# EAGLE schematic Multivibrator (EAGLE 9.6.2)
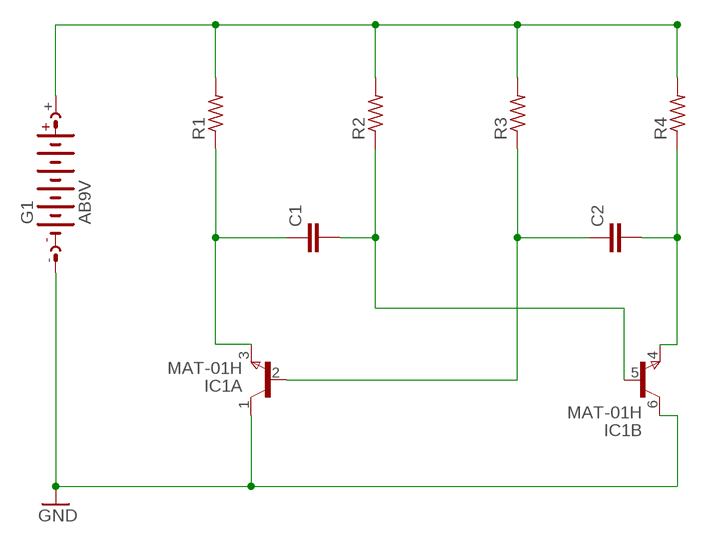
[diagram p0: schematic, sheet 1]

## Parts
C1  C2,5-3  [C2.5-3]
C2  C2,5-3  [C2.5-3]
G1  AB9V  [AB9V]
IC1  MAT-01H  [TO78]
R1  R-US_R0805  [R0805]
R2  R-US_R0805  [R0805]
R3  R-US_R0805  [R0805]
R4  R-US_R0805  [R0805]

## Nets
GND: G1.- IC1.1(A:C) IC1.6(B:C)
N$1: G1.+ R1.2 R2.2 R3.2 R4.2
N$2: C1.1 IC1.3(A:E) R1.1
N$3: C1.2 IC1.5(B:B) R2.1
N$4: C2.1 IC1.2(A:B) R3.1
N$5: C2.2 IC1.4(B:E) R4.1

## Library data of the parts
C1 C2 = capacitor-wima:C: CAPACITOR naming: grid - package width
G1 = battery:AB9V: 9-V BATTERY CLIP
IC1 = linear:MAT-01H: Dual TRANSISTOR
R1-R4 = rcl:R-US_: RESISTOR, American symbol; SPICEPREFIX: R